# EAGLE board FrequencyCounter (EAGLE 7.2.0)
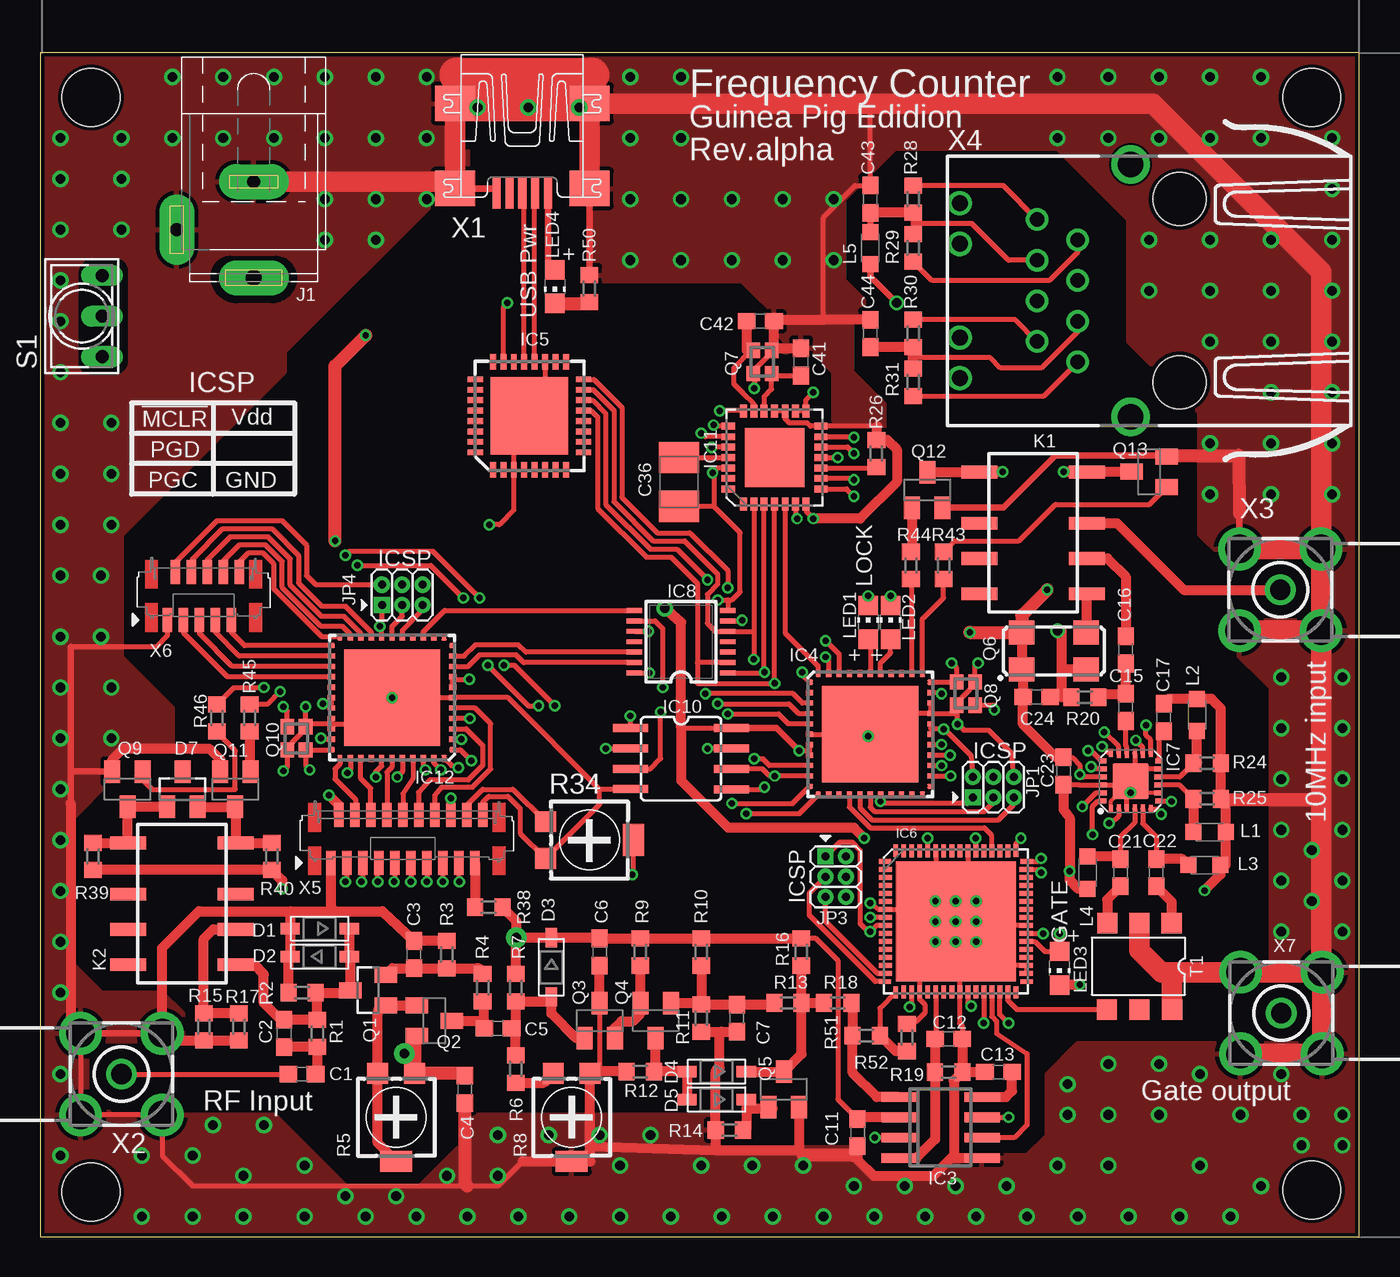
[diagram p2: board, top side]
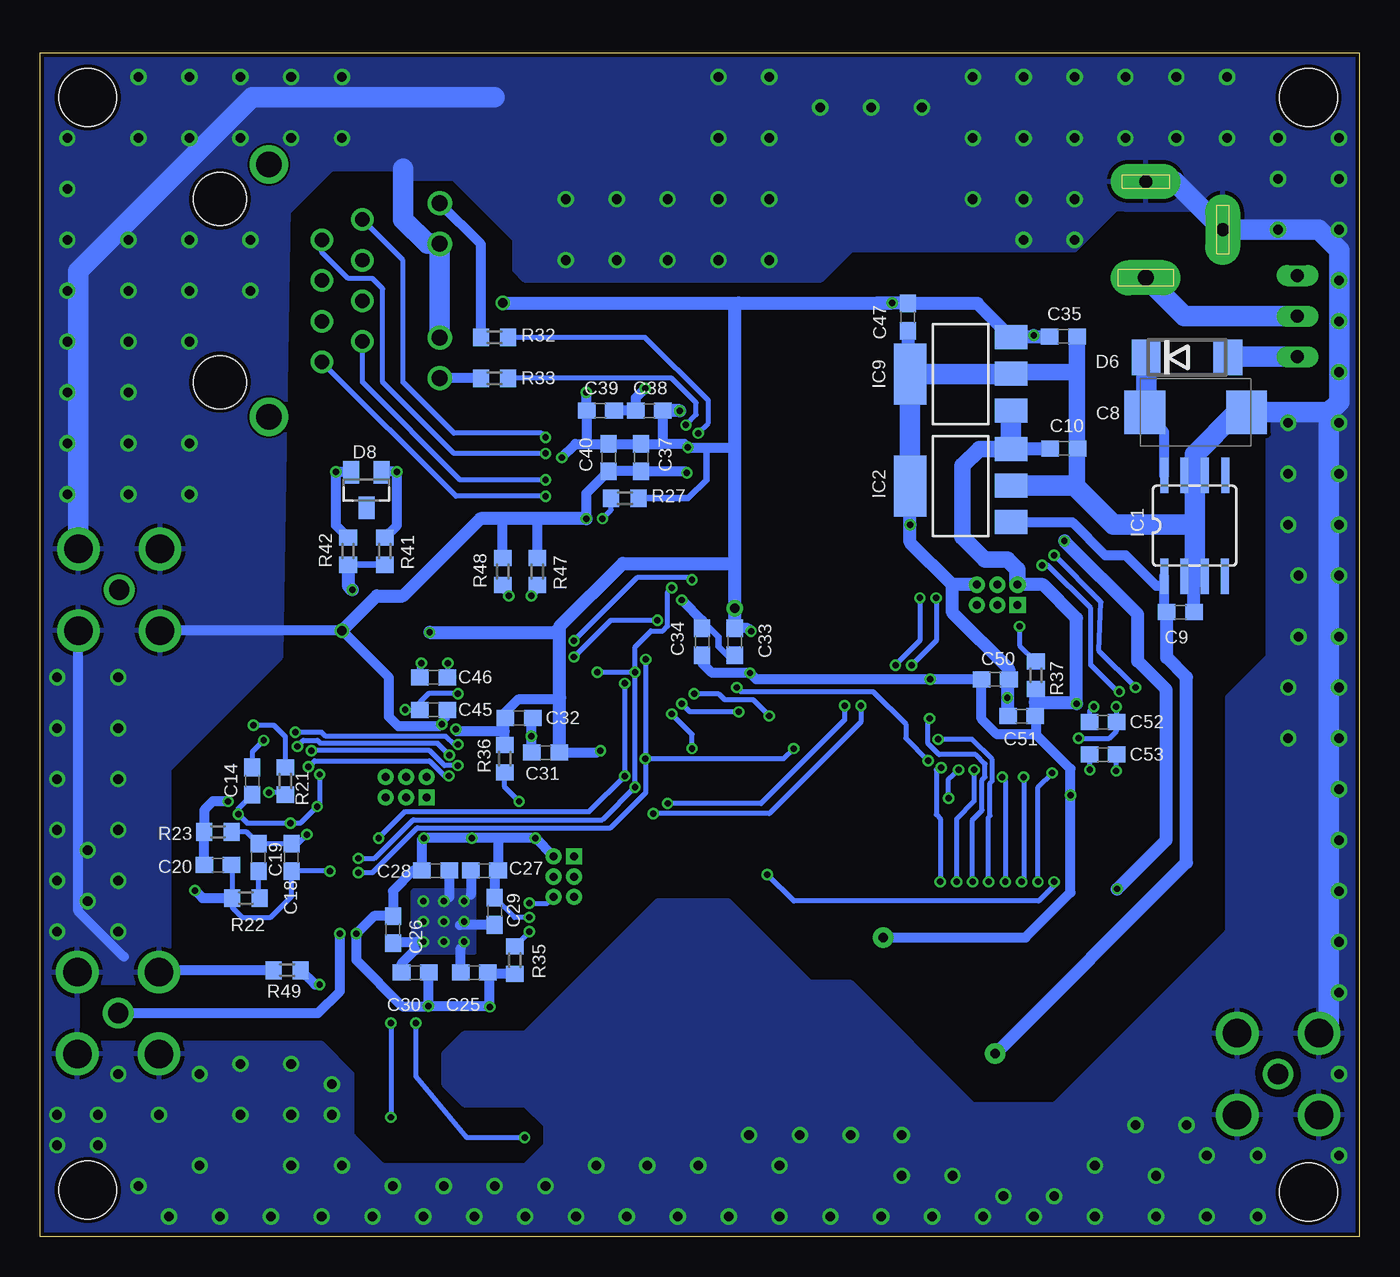
[diagram p3: board, bottom side, seen from below]

Size 82.35 x 73.9 mm. Coordinates in mm from the lower left corner, seen from the top.
Outline: 0,0 82.35,0 82.35,73.9 0,73.9 0,0
Copper layers (1*16): Top 0.035mm / dielectric 1.5mm / Bottom 0.035mm
Design rules "dirt_cheap_dirty_boards.v1 *": minimum track width 5mil, minimum drill 12mil, track to track 5mil, track to pad 5mil, pad to pad 5mil, via to via 5mil, smd to smd 0mil, copper to edge 10mil, drill to drill 10mil, minimum pad ring 10mil, minimum via ring 6mil, stop-mask expansion 2mil, vias tented up to drill 25mil, thermal gap 10mil
Holes 3.6 mm at 79.38,71.12 3.17,71.12 3.17,2.79 79.38,2.92

## Footprints (pad centres in the part's own frame; a part is rotated, then mirrored left to right if it is on the bottom)
C0603 = smd 1.1 x 1: 1 -0.85,0; 2 0.85,0
D/7343-31R = smd 2.55 x 2.7: + 3.175,0; - -3.175,0
B/3528-21R = smd 1.95 x 2.5: + 1.525,0; - -1.525,0
SOD-123 = smd 1.2 x 0.7: A 1.85,0; C -1.85,0
DO214AA = smd 1.8 x 2.2: A 2.55,0; C -2.55,0
SOT23 = smd 1 x 1.4: 1 -0.95,-1.1; 2 0.95,-1.1; 3 0,1.1
SOIC8 = smd 2.2 x 0.5: 1 -3.154,1.905; 2 -3.154,0.645; 3 -3.154,-0.625; 4 -3.154,-1.895; 5 3.154,-1.905; 6 3.154,-0.635; 7 3.154,0.635; 8 3.154,1.905
SOT223 = smd 1.499 x 2.007: 1 -2.261,-3.15; 2 0.025,-3.15; 3 2.311,-3.15 | smd 3.81 x 2.007: 4 0,3.15
SO08 = smd 0.6 x 2.2: 1 -1.905,-2.6; 2 -0.635,-2.6; 3 0.635,-2.6; 4 1.905,-2.6; 5 1.905,2.6; 6 0.635,2.6; 7 -0.635,2.6; 8 -1.905,2.6
QFN44ML8X8 = smd 0.45 x 0.33: 1 -3.788,3.25; 2 -3.788,2.6; 3 -3.788,1.95; 4 -3.788,1.3; 5 -3.788,0.65; 6 -3.788,0; 7 -3.788,-0.65; 8 -3.788,-1.3; 9 -3.788,-1.95; 10 -3.788,-2.6; 11 -3.788,-3.25; 23 3.788,-3.25; 24 3.788,-2.6; 25 3.788,-1.95; 26 3.788,-1.3; 27 3.788,-0.65; 28 3.788,0; 29 3.788,0.65; 30 3.788,1.3; 31 3.788,1.95; 32 3.788,2.6; 33 3.788,3.25 | smd 0.33 x 0.45: 12 -3.25,-3.788; 13 -2.6,-3.788; 14 -1.95,-3.788; 15 -1.3,-3.788; 16 -0.65,-3.788; 17 0,-3.788; 18 0.65,-3.788; 19 1.3,-3.788; 20 1.95,-3.788; 21 2.6,-3.788; 22 3.25,-3.788; 34 3.25,3.788; 35 2.6,3.788; 36 1.95,3.788; 37 1.3,3.788; 38 0.65,3.788; 39 0,3.788; 40 -0.65,3.788; 41 -1.3,3.788; 42 -1.95,3.788; 43 -2.6,3.788; 44 -3.25,3.788 | smd 6 x 6: EXP 0,0
TQFN32 = smd 0.965 x 0.366: 1 -3.378,2.275; 2 -3.378,1.625; 3 -3.378,0.975; 4 -3.378,0.325; 5 -3.378,-0.325; 6 -3.378,-0.975; 7 -3.378,-1.625; 8 -3.378,-2.275; 17 3.378,-2.275; 18 3.378,-1.625; 19 3.378,-0.975; 20 3.378,-0.325; 21 3.378,0.325; 22 3.378,0.975; 23 3.378,1.625; 24 3.378,2.275 | smd 0.366 x 0.965: 9 -2.275,-3.378; 10 -1.625,-3.378; 11 -0.975,-3.378; 12 -0.325,-3.378; 13 0.325,-3.378; 14 0.975,-3.378; 15 1.625,-3.378; 16 2.275,-3.378; 25 2.275,3.378; 26 1.625,3.378; 27 0.975,3.378; 28 0.325,3.378; 29 -0.325,3.378; 30 -0.975,3.378; 31 -1.625,3.378; 32 -2.275,3.378 | smd 4.851 x 4.851: EXP 0,0
QFN64_9X9MC = smd 0.762 x 0.305: 1 -4.42,3.75; 16 -4.42,-3.75; 33 4.42,-3.75; 48 4.42,3.75 | smd 0.813 x 0.305: 2 -4.394,3.25; 3 -4.394,2.75; 4 -4.394,2.25; 5 -4.394,1.75; 6 -4.394,1.25; 7 -4.394,0.75; 8 -4.394,0.25; 9 -4.394,-0.25; 10 -4.394,-0.75; 11 -4.394,-1.25; 12 -4.394,-1.75; 13 -4.394,-2.25; 14 -4.394,-2.75; 15 -4.394,-3.25; 34 4.394,-3.25; 35 4.394,-2.75; 36 4.394,-2.25; 37 4.394,-1.75; 38 4.394,-1.25; 39 4.394,-0.75; 40 4.394,-0.25; 41 4.394,0.25; 42 4.394,0.75; 43 4.394,1.25; 44 4.394,1.75; 45 4.394,2.25; 46 4.394,2.75; 47 4.394,3.25 | smd 0.305 x 0.762: 17 -3.75,-4.42; 32 3.75,-4.42; 49 3.75,4.42; 64 -3.75,4.42 | smd 0.305 x 0.813: 18 -3.25,-4.394; 19 -2.75,-4.394; 20 -2.25,-4.394; 21 -1.75,-4.394; 22 -1.25,-4.394; 23 -0.75,-4.394; 24 -0.25,-4.394; 25 0.25,-4.394; 26 0.75,-4.394; 27 1.25,-4.394; 28 1.75,-4.394; 29 2.25,-4.394; 30 2.75,-4.394; 31 3.25,-4.394; 50 3.25,4.394; 51 2.75,4.394; 52 2.25,4.394; 53 1.75,4.394; 54 1.25,4.394; 55 0.75,4.394; 56 0.25,4.394; 57 -0.25,4.394; 58 -0.75,4.394; 59 -1.25,4.394; 60 -1.75,4.394; 61 -2.25,4.394; 62 -2.75,4.394; 63 -3.25,4.394 | smd 7.493 x 7.493: 65 0,0
LFCSP24 = smd 0.5 x 0.3: 1 -1.75,1.25; 6 -1.75,-1.25; 13 1.75,-1.25; 18 1.75,1.25 | smd 0.55 x 0.3: 2 -1.725,0.75; 3 -1.725,0.25; 4 -1.725,-0.25; 5 -1.725,-0.75; 14 1.725,-0.75; 15 1.725,-0.25; 16 1.725,0.25; 17 1.725,0.75 | smd 0.3 x 0.5: 7 -1.25,-1.75; 12 1.25,-1.75; 19 1.25,1.75; 24 -1.25,1.75 | smd 0.3 x 0.55: 8 -0.75,-1.725; 9 -0.25,-1.725; 10 0.25,-1.725; 11 0.75,-1.725; 20 0.75,1.725; 21 0.25,1.725; 22 -0.25,1.725; 23 -0.75,1.725 | smd 2.25 x 2.25: EXP 0,0
TSSOP14 = smd 0.991 x 0.305: 1 -2.918,1.95; 2 -2.918,1.3; 3 -2.918,0.65; 4 -2.918,0; 5 -2.918,-0.65; 6 -2.918,-1.3; 7 -2.918,-1.95; 8 2.918,-1.95; 9 2.918,-1.3; 10 2.918,-0.65; 11 2.918,0; 12 2.918,0.65; 13 2.918,1.3; 14 2.918,1.95
QFN65P600X600X100-29N = smd 0.813 x 0.432: 1 -2.896,1.956; 2 -2.896,1.295; 3 -2.896,0.66; 4 -2.896,0; 5 -2.896,-0.66; 6 -2.896,-1.295; 7 -2.896,-1.956; 15 2.896,-1.956; 16 2.896,-1.295; 17 2.896,-0.66; 18 2.896,0; 19 2.896,0.66; 20 2.896,1.295; 21 2.896,1.956 | smd 0.432 x 0.813: 8 -1.956,-2.896; 9 -1.295,-2.896; 10 -0.66,-2.896; 11 0,-2.896; 12 0.66,-2.896; 13 1.295,-2.896; 14 1.956,-2.896; 22 1.956,2.896; 23 1.295,2.896; 24 0.66,2.896; 25 0,2.896; 26 -0.66,2.896; 27 -1.295,2.896; 28 -1.956,2.896 | smd 3.708 x 3.708: 29 0,0
SPC4077 = drill 0.8 pad 2.184 long: 1 -3,0; 2 0,-4.8 | drill 1 pad 2.184 long: 3 3,0
2X03_1.27 = drill 0.5 square: 1 -1.27,-0.635 | drill 0.5: 2 -1.27,0.635; 3 0,-0.635; 4 0,0.635; 5 1.27,-0.635; 6 1.27,0.635
FTR-B4S = smd 0.8 x 2.25: 1 -3.8,-3.345; 2 -0.6,-3.345; 3 1.6,-3.345; 4 3.8,-3.345; 5 3.8,3.345; 6 1.6,3.345; 7 -0.6,3.345; 8 -3.8,3.345
L2012C = smd 1 x 1: 1 -1,0; 2 1,0
CHIP-LED0805 = smd 1.2 x 1.2: A 0,-1.05; C 0,1.05
SOT23-BEC = smd 1 x 1.4: B -0.95,-1.1; C 0,1.1; E 0.95,-1.1
FOX924 = smd 1.6 x 1.5: 1 -1.885,-1.15; 2 2.139,-1.15; 3 2.139,1.15; 4 -1.885,1.15
FA-128 = smd 0.95 x 0.85: 1 -0.725,-0.575; 2 0.725,-0.575; 3 0.725,0.575; 4 -0.725,0.575
R0603 = smd 1 x 1.1: 1 -0.85,0; 2 0.85,0
RTRIM4G/J = smd 1.3 x 1.3: 1 -1.15,-2.75; 3 1.15,-2.75 | smd 2 x 1.3: 2 0,2.75
9450-1-NOHOLE = drill 0.813 long: 1 -2.54,-1.27; 2 0,-1.27; 3 2.54,-1.27
PULSE_CX20 = smd 1.27 x 1.27: P$1 -2.696,1.905; P$2 -2.696,-0.095; P$3 -2.696,-2.095; P$4 2.696,-2.127; P$5 2.696,-0.095; P$6 2.696,1.937
UX60A-MB-5ST = smd 2 x 0.5: 1 2.25,1.6; 2 2.25,0.8; 3 2.25,0; 4 2.25,-0.8; 5 2.25,-1.6 | smd 2.2 x 2.5: M1 -3.3,-4.2; M2 -3.3,4.2; M3 2,4.2; M4 2,-4.2
BU-SMA-H = drill 1.27: 1 0,0 | drill 1.778: 2 -2.55,2.55; 3 2.55,2.55; 4 2.55,-2.55; 5 -2.55,-2.55
J1 = drill 0.9 pad 1.3: 1 4.445,2.54; 2 3.175,0; 3 1.905,2.54; 4 0.635,0; 5 -0.635,2.54; 6 -1.905,0; 7 -3.175,2.54; 8 -4.445,0 | drill 1 pad 1.422: 9 5.465,7.37; 10 2.925,7.37; 11 -2.925,7.37; 12 -5.465,7.37 | drill 1.6 pad 2.184: M1 -7.875,-3.3; M2 7.875,-3.3 | hole 3.3: 5.715,-6.35; -5.715,-6.35
FH12-20S-0.5SV = smd 0.6 x 1.5: 1 -4.46,-1.5; 2 -3.96,1.5; 3 -3.46,-1.5; 4 -2.96,1.5; 5 -2.46,-1.5; 6 -1.96,1.5; 7 -1.46,-1.5; 8 -0.96,1.5; 9 -0.46,-1.5; 10 0.04,1.5; 11 0.54,-1.5; 12 1.04,1.5; 13 1.54,-1.5; 14 2.04,1.5; 15 2.54,-1.5; 16 3.04,1.5; 17 3.54,-1.5; 18 4.04,1.5; 19 4.54,-1.5; 20 5.04,1.5
FH12-10S-0.5SV = smd 0.6 x 1.5: 1 -2.21,-1.5; 2 -1.71,1.5; 3 -1.21,-1.5; 4 -0.71,1.5; 5 -0.21,-1.5; 6 0.29,1.5; 7 0.79,-1.5; 8 1.29,1.5; 9 1.79,-1.5; 10 2.29,1.5

## Placement (x,y rotation side)
C1  1.5uF  [C0603]  16.35,10.16 0 top
C2  47pF  [C0603]  15.24,12.7 90 top
C3  470pF  [C0603]  23.34,17.62 90 top
C4  0.1  [C0603]  26.51,9.21 270 top
C5  47nF  [C0603]  28.57,13.02 180 top
C6  0.1  [C0603]  34.92,17.78 270 top
C7  56pF  [C0603]  43.5,13.65 90 top
C8  100uF  [D/7343-31R]  10.22,51.47 180 bottom
C9  1uF  [C0603]  11.18,38.99 0 bottom
C10  1uF  [C0603]  18.45,49.21 0 bottom
C11  0.1  [C0603]  51.02,6.51 270 top
C12  8pF  [C0603]  56.71,12.35 0 top
C13  0.1  [C0603]  59.82,10.29 180 top
C14  10uF  [C0603]  69.1,28.45 270 bottom
C15  1nF  [C0603]  67.75,33.05 90 top
C16  1nF  [C0603]  67.75,36.64 90 top
C17  1nF  [C0603]  70.14,32.42 90 top
C18  47pF  [C0603]  66.64,23.69 90 bottom
C19  680pF  [C0603]  68.71,23.69 90 bottom
C20  22nF  [C0603]  71.25,23.21 180 bottom
C21  100pF  [C0603]  67.44,22.73 270 top
C22  100pF  [C0603]  69.66,22.73 90 top
C23  0.1  [C0603]  63.88,29.08 270 top
C24  0.1  [C0603]  62.2,33.69 0 top
C25  0.1  [C0603]  55.24,16.51 180 bottom
C26  0.1  [C0603]  60.33,19.18 270 bottom
C27  0.1  [C0603]  54.61,22.86 180 bottom
C28  0.1  [C0603]  57.66,22.86 0 bottom
C29  0.1  [C0603]  53.98,20.32 270 bottom
C30  0.1  [C0603]  58.93,16.51 180 bottom
C31  0.1  [C0603]  50.8,30.23 180 bottom
C32  0.1  [C0603]  52.45,32.38 0 bottom
C33  0.1  [C0603]  38.99,37.15 270 bottom
C34  0.1  [C0603]  41.02,37.15 90 bottom
C35  1uF  [C0603]  18.48,56.2 0 bottom
C36  10uF  [B/3528-21R]  39.88,47.12 90 top
C37  0.1  [C0603]  44.83,48.64 270 bottom
C38  0.1  [C0603]  44.32,51.56 180 bottom
C39  0.1  [C0603]  47.37,51.56 0 bottom
C40  0.1  [C0603]  46.86,48.64 270 bottom
C41  18pF  [C0603]  47.5,54.61 90 top
C42  18pF  [C0603]  44.96,57.15 0 top
C43  0.01uF  [C0603]  51.82,64.77 90 top
C44  0.01uF  [C0603]  51.82,56.39 90 top
C45  18pF  [C0603]  57.78,32.89 0 bottom
C46  18pF  [C0603]  57.78,34.92 180 bottom
C47  0.1  [C0603]  28.19,57.4 270 bottom
C50  0.1  [C0603]  22.73,34.8 0 bottom
C51  0.1  [C0603]  21.08,32.51 180 bottom
C52  18pF  [C0603]  16,32.13 180 bottom
C53  18pF  [C0603]  16,30.1 0 bottom
D1  1N4148  [SOD-123]  17.46,19.24 180 top
D2  1N4148  [SOD-123]  17.46,17.49 0 top
D3  1N4148  [SOD-123]  31.91,16.83 270 top
D4  1N4148  [SOD-123]  42.23,10.32 180 top
D5  1N4148  [SOD-123]  42.23,8.57 180 top
D6  SS24  [DO214AA]  10.76,54.9 0 bottom
D7  DZ23  [SOT23]  8.89,27.94 0 top
D8  DZ23  [SOT23]  61.98,46.61 180 bottom
IC1  UA7809  [SOIC8]  10.29,44.39 90 bottom
IC2  UA78M05  [SOT223]  24.89,46.86 90 bottom
IC3  MC12080D  [SO08]  56.2,6.83 270 top
IC4  PIC18F4550_QFN  [QFN44ML8X8]  51.82,31.37 0 top
IC5  MAX3421E  [TQFN32]  30.54,51.24 90 top
IC6  PIC32MZXXXXEC(G/H/M)064-I/MR  [QFN64_9X9MC]  57.15,19.68 0 top
IC7  ADF4360-8  [LFCSP24]  68.07,28.45 90 top
IC8  MAX33XXE  [TSSOP14]  40.01,37.15 180 top
IC9  UA78M33  [SOT223]  24.89,53.85 90 bottom
IC10  SST25  [SOIC8]  40.01,29.84 0 top
IC11  ENC28J60-I/ML  [QFN65P600X600X100-29N]  45.85,48.64 90 top
IC12  PIC18F4550_QFN  [QFN44ML8X8]  21.97,33.66 180 top
J1  JACK  [SPC4077]  13.34,62.87 270 top
JP1  PINHEAD  [2X03_1.27]  59.5,28.07 0 top
JP3  PINHEAD  [2X03_1.27]  49.66,22.48 270 top
JP4  PINHEAD  [2X03_1.27]  22.61,40.07 0 top
K1  FTR-B4S  [FTR-B4S]  61.98,43.94 270 top
K2  FTR-B4S  [FTR-B4S]  8.86,20.8 270 top
L1  68nH  [L2012C]  72.99,25.27 0 top
L2  68nH  [L2012C]  72.2,32.58 90 top
L3  56nH  [L2012C]  72.68,23.21 0 top
L4  56nH  [L2012C]  65.37,22.73 270 top
L5  15uH  [L2012C]  51.82,61.72 90 top
LED1  [CHIP-LED0805]  51.69,38.35 0 top
LED2  [CHIP-LED0805]  53.09,38.35 0 top
LED3  [CHIP-LED0805]  63.63,16.76 180 top
LED4  [CHIP-LED0805]  32.13,59.31 180 top
Q1  SST5484  [SOT23]  20.48,15.4 90 top
Q2  BFT92  [SOT23-BEC]  24.61,13.49 270 top
Q3  BFT92  [SOT23-BEC]  34.92,13.49 0 top
Q4  BFT92  [SOT23-BEC]  38.42,13.49 180 top
Q5  BFT93  [SOT23-BEC]  46.42,9.21 0 top
Q6  FOX924  [FOX924]  63.15,36.58 0 top
Q7  FA-128  [FA-128]  45.09,54.61 90 top
Q8  FA-128  [FA-128]  57.78,33.91 90 top
Q9  BC817  [SOT23-BEC]  5.46,27.94 180 top
Q10  FA-128  [FA-128]  16,31.11 270 top
Q11  BC817  [SOT23-BEC]  12.19,27.94 180 top
Q12  BC817  [SOT23-BEC]  55.37,46.61 0 top
Q13  BC817  [SOT23-BEC]  69.22,47.75 90 top
R1  100K  [R0603]  17.3,12.7 270 top
R2  1M  [R0603]  16.35,15.24 180 top
R3  100  [R0603]  25.4,17.62 90 top
R4  300  [R0603]  27.62,15.56 90 top
R5  500  [RTRIM4G/J]  22.23,7.46 180 top
R6  15K  [R0603]  29.69,10.48 270 top
R7  15K  [R0603]  29.69,15.56 270 top
R8  6.8K  [RTRIM4G/J]  33.18,7.46 180 top
R9  100  [R0603]  37.47,17.78 270 top
R10  470  [R0603]  41.27,17.78 270 top
R11  1K  [R0603]  41.27,13.65 270 top
R12  300  [R0603]  37.47,10.32 180 top
R13  8.2k  [R0603]  46.67,14.61 180 top
R14  1K  [R0603]  43.02,6.67 180 top
R15  100  [R0603]  10.22,13.11 270 top
R16  1K  [R0603]  47.5,17.78 270 top
R17  100  [R0603]  12.41,13.11 270 top
R18  1K  [R0603]  49.78,14.61 180 top
R19  820  [R0603]  56.71,10.29 0 top
R20  51  [R0603]  65.21,33.69 180 top
R21  4.7k  [R0603]  67.04,28.45 270 bottom
R22  6.8k  [R0603]  69.5,21.15 180 bottom
R23  15k  [R0603]  71.25,25.27 0 bottom
R24  470  [R0603]  72.83,29.56 0 top
R25  470  [R0603]  72.83,27.34 0 top
R26  2k 1%  [R0603]  52.2,48.9 90 top
R27  10k  [R0603]  45.85,46.1 0 bottom
R28  50 1%  [R0603]  54.48,64.77 90 top
R29  50 1%  [R0603]  54.48,61.72 90 top
R30  50 1%  [R0603]  54.48,56.39 90 top
R31  50 1%  [R0603]  54.48,53.34 90 top
R32  180  [R0603]  53.98,56.13 0 bottom
R33  180  [R0603]  53.98,53.59 0 bottom
R34  10K  [RTRIM4G/J]  34.29,24.77 270 top
R35  4.7k  [R0603]  52.7,17.27 90 bottom
R36  4.7k  [R0603]  53.34,29.84 270 bottom
R37  4.7k  [R0603]  20.19,35.05 90 bottom
R38  4.7k  [R0603]  28,20.57 0 top
R39  47  [R0603]  3.3,23.75 90 top
R40  47  [R0603]  14.48,23.75 90 top
R41  47  [R0603]  60.83,42.8 90 bottom
R42  47  [R0603]  63.12,42.8 90 bottom
R43  4.7k  [R0603]  56.39,41.91 90 top
R44  4.7k  [R0603]  54.36,41.91 90 top
R45  4.7k  [R0603]  13.08,32.38 270 top
R46  4.7k  [R0603]  11.05,32.38 90 top
R47  180  [R0603]  51.31,41.53 90 bottom
R48  180  [R0603]  53.47,41.53 90 bottom
R49  180  [R0603]  66.93,16.64 180 bottom
R50  180  [R0603]  34.29,59.18 90 top
R51  [R0603]  51.56,12.57 0 top
R52  [R0603]  54.1,12.45 90 top
S1  9450-1NOHOLE  [9450-1-NOHOLE]  2.6,57.47 90 top
T1  CX20XX  [PULSE_CX20]  68.71,16.89 270 top
X1  MINI-USB-SHIELD  [UX60A-MB-5ST]  30.1,67.44 270 top
X2  BU-SMA-H  [BU-SMA-H]  5.08,10.16 180 top
X3  BU-SMA-H  [BU-SMA-H]  77.41,40.39 0 top
X4  J1006F01P  [J1]  64.77,59.05 90 top
X5  FH12-20S-0.5SV  [FH12-20S-0.5SV]  22.61,24.83 0 top
X6  FH12-10S-0.5SV  [FH12-10S-0.5SV]  10.16,40.01 0 top
X7  BU-SMA-H  [BU-SMA-H]  77.47,13.97 0 top

## Tracks (layer width: path | path; a pad name or v marks a point on that pad's centre or on a via)
50TERM_RESET  (via drill 0.4 pad 0.61)
  Top 0.305: R46.2 12.1,34.29 v13.97,34.29 | v19.05,42.55 19.3,42.8 24.51,42.8 v27.43,39.88 | v43.18,27.05 46.96,27.05 IC4.11 | v28.96,35.69 29.59,35.69 v32.13,33.15
  Bottom 0.305: v13.97,34.29 16.26,36.58 16.13,39.62 v19.05,42.55 | v43.18,27.05 37.34,27.05 32.13,32.26 v32.13,33.15 | v27.43,39.88 27.43,37.21 v28.96,35.69
50TERM_SET  (via drill 0.4 pad 0.61)
  Top 0.305: v19.81,41.91 24.38,41.91 v26.42,39.88 | R45.1 13.12,33.27 14.22,33.27 v14.99,34.04 | v44.07,26.42 47.4,26.42 IC4.12 | v27.94,35.69 30.48,33.15 v31.11,33.15
  Bottom 0.305: v19.81,41.91 19.43,41.91 16.76,39.24 16.76,35.69 15.11,34.04 v14.99,34.04 | v44.07,26.42 36.83,26.42 31.11,32.13 v31.11,33.15 | v26.42,39.88 26.42,37.21 v27.94,35.69
+3V3  (via drill 0.4 pad 0.41, 0.4 pad 0.61, 0.6 pad 0.81, 0.6 pad 1.02)
  Top 0.305: IC7.6 69.66,26.7 v69.98,26.38 | IC7.23 65.89,27.7 v65.06,26.86 | IC7.2 67.32,26.24 66.91,25.83 v66.72,25.83 | C23.1 64.32,29.88 64.48,29.88 64.9,29.46 v64.9,28.86 65.06,28.7 IC7.21 | IC6.39 62.23,18.93 v62.61,18.92 | IC6.54 v58.4,24.89 | IC6.19 54.4,14.59 v54.28,14.35 | IC6.26 57.9,14.62 v58.12,14.4 | IC6.60 v55.4,24.89 | IC4.28 IC4.29 55.6,31.69 v56.39,31.69 56.52,31.62 58.1,30.04 JP1.2 | IC4.7 IC4.8 48.03,30.35 v47.37,30.35 | IC11.16 IC11.15 47.8,52.25 v48.26,52.7 | IC11.24 42.14,49.3 v41.91,49.28 | IC11.11 v49.78,48.64 | IC11.21 43.87,51.56 v42.42,51.56 | Q6.1 61.35,35.6 | IC6.8 52.45,19.94 v51.82,19.94 | IC8.10 v37.97,37.8 | 40.01,31.75 42.55,31.75 | IC5.23 28.92,58.04 v29.17,58.29
  Top 0.406: v47.37,30.35 45.97,31.75 IC10.8 | L5.1 51.82,59.94 v53.47,58.29
  Top 0.61: C23.1 63.41,29.93 61.35,32 C24.1 61.35,35.6 | v38.99,39.24 40.01,38.35 40.01,31.75 40.01,28.48 42.96,25.53 50.8,25.53 v51.44,24.89 | Q6.4 Q6.1 | R39.1 R40.1 15.11,22.26 v15.11,21.72
  Top 0.813: v58.03,37.73 Q6.4 61.27,38.79 v62.87,40.39 | v18.41,43.43 18.41,54.36 v20.32,56.26
  Bottom 0.305: v69.98,26.38 69.98,26.73 C14.2 | 69.82,26.23 v69.98,26.38 | v69.98,26.38 69.42,25.83 v66.72,25.83 66.09,25.83 v65.06,26.86 64.9,27.02 v64.9,28.86 | v54.28,14.35 54.41,14.49 54.49,14.4 | C30.1 58.12,16.47 | 58.51,24.78 v58.4,24.89 | 53.98,22.64 C27.1 53.72,22.9 | 54.41,16.5 C25.1 54.4,16.42 | 48.26,51.6 C39.1 | 44.79,49.53 C37.1 | C40.1 48.22,49.49 | 53.34,32.35 C32.1 | v51.82,19.94 52.74,19.94 C29.1 | 50.04,33.53 49.91,33.66 | 56.33,31.56 56.33,31.62 | 50.28,37.73 arc-90 49.91,38.1
  Bottom 0.406: 45.09,46.1 41.91,46.1 40.77,47.24 40.77,49.28 v41.91,49.28 | R42.1 R41.1 | 38.99,58.04 38.73,58.29
  Bottom 0.61: 58.12,16.47 v58.12,14.4 | 58.51,24.78 C28.1 59.05,22.86 60.33,21.59 C26.1 61.51,20.03 v62.61,18.92 62.61,17.27 59.74,14.4 v58.12,14.4 | 53.98,22.64 C29.1 | 54.49,14.4 v58.12,14.4 | v58.4,24.89 v55.4,24.89 53.72,24.89 | C31.1 47.62,30.23 v47.37,30.35 | 50.04,33.53 52.53,33.53 53.3,32.75 C32.1 | v48.26,52.7 48.26,51.6 | v49.78,48.64 48.93,49.49 C40.1 C37.1 43.47,49.49 | 43.47,49.49 C38.1 | 43.47,49.49 42.12,49.49 v41.91,49.28 38.99,49.28 38.99,49.4 | 48.22,49.49 C39.1 | R35.1 54.4,16.42 | 53.72,24.89 v51.44,24.89 JP3.2 | 53.72,22.9 53.72,24.89 | v37.97,37.8 38.17,38 C33.1 | R27.2 45.09,46.1 | R36.1 53.34,31.56 | 53.34,31.56 53.34,32.35 | 53.34,31.56 56.33,31.56 | 56.33,31.62 v56.39,31.69 | v54.28,14.35 54.28,16.39 C25.1
  Bottom 0.813: v42.42,51.56 C38.1 | 20.32,56.2 21.74,56.2 IC9.3 23.84,58.25 C47.1 28.23,58.29 v29.17,58.29 | 20.32,56.2 C35.1 | C31.1 49.91,30.23 49.91,33.66 49.91,38.1 45.97,42.04 38.99,42.04 | C33.1 v38.99,39.24 38.99,42.04 | 38.99,42.04 38.99,49.4 38.99,58.04 | v58.03,37.73 50.28,37.73 | R42.1 63.12,40.64 v62.87,40.39 | v15.11,21.72 12.06,24.77 12.06,34.16 13.84,35.94 13.84,38.86 v18.41,43.43 | v20.32,56.26 20.32,56.2 | v29.17,58.29 30.1,58.29 | v53.47,58.29 38.73,58.29 v29.17,58.29
+5V  (via drill 0.4 pad 0.61, 0.6 pad 1.27)
  Top 0.305: R16.1 48.43,18.63 49.78,17.27 49.78,8.6 C11.1 | IC12.29 IC12.28 18.18,33.27 v17.65,33.27 | IC8.14 v38.04,35.2 | v26.8,34.8 25.76,34.8 IC12.8 IC12.7 | X6.2 8.45,42.1 11.05,44.7 15.11,44.7 16.64,43.18 16.64,41.27 17.21,40.7 JP4.2
  Top 0.61: R7.1 29.72,16.44 v29.72,18.68 | R16.1 R10.1 R9.1 C6.1 34.88,18.68 D3.C v29.72,18.68 | IC3.2 51.28,7.46 C11.1 | X5.2 18.65,26.95 v18.03,27.56 | R38.2 29.72,19.71 v29.72,18.68
  Bottom 0.305: R37.1 20.23,34.16
  Bottom 0.61: 17.72,33.37 arc90 v17.65,33.27 | C51.1 20.19,32.51 20.19,31.37 | 20.19,31.37 22.62,31.37 23.58,32.34 C50.1 v26.8,34.8 37.64,34.8 v38.04,35.2 40.4,35.2 41.02,35.82 C34.1 | 20.19,31.37 18.03,29.21 v18.03,27.56 18.03,21.49 20.85,18.68 v29.72,18.68
  Bottom 0.813: IC2.3 21.74,49.21 C10.1 | 20.23,34.16 20.23,33.37 | 20.23,33.37 C51.1 | 20.23,33.37 17.72,33.37 | v17.65,33.27 17.65,38.61 19.75,40.7 JP4.2
  Bottom 1.016: JP4.2 21.34,41.66 21.97,42.29 23.37,42.29 24.77,43.69 24.77,48.13 23.72,49.17 IC2.3
  Bottom 1.27: IC2.3 IC9.1
+9V  (via drill 0.6 pad 1.27)
  Top 0.305: Q2.E 23.38,12.41
  Top 0.61: C4.1 26.51,10.21
  Top 0.813: 26.51,10.21 R5.1 23.38,11.43 | 23.38,12.41 23.38,11.43 | 23.38,11.43 v22.73,11.43
  Bottom 0.61: C9.1 12.19,39.16 12.19,40.64 | 12.19,40.64 IC1.1 | IC2.1 17.93,44.6 15.88,42.55 14.61,42.55 12.7,40.64 12.19,40.64
  Bottom 0.813: v22.73,11.43 10.79,23.37 10.79,34.92 12.03,36.16 C9.1
+12V
  Bottom 1.27: S1.2 10.94,57.47 J1.3
ATT_FREQ
  Top 0.305: IC6.17 52.41,14.28 R51.2
  Top 0.61: R51.2 53.39,11.6 R52.1
BUT1
  Top 0.305: IC12.26 11.7,34.95 8.95,37.7 X6.3
BUT2
  Top 0.305: X6.4 9.53,41.51 9.53,42.31 11.41,44.2 14.47,44.2 16.13,42.54 16.13,40.82 17.58,39.37 19.05,39.37 20.67,37.75 IC12.19
BUT3
  Top 0.305: IC12.25 11.99,35.6 9.95,37.65 X6.5
BUT4
  Top 0.305: IC12.20 20.02,37.69 18.98,38.73 17.56,38.73 15.62,40.68 15.62,42.31 14.25,43.69 11.86,43.69 10.45,42.28 X6.6
BUT5
  Top 0.305: IC12.24 12.44,36.26 10.95,37.74 X6.7
BUT6
  Top 0.305: IC12.21 19.37,37.6 18.87,38.1 17.56,38.1 15.11,40.54 15.11,42.16 14.09,43.18 12.42,43.18 11.43,42.19 11.43,41.51 X6.8
BUT7
  Top 0.305: IC12.23 12.76,36.91 11.95,37.72 X6.9
BUT8
  Top 0.305: IC12.22 17.59,37.44 14.61,40.43 14.61,41.99 13.92,42.67 12.99,42.67 12.45,42.14 X6.10
COUNTER_CLOCK
  Top 0.305: IC6.31 60.4,14.78 60.98,14.2 T1.P$4
COUNTER_MCLR  (via drill 0.4 pad 0.61)
  Top 0.305: JP3.1 49.91,24.64 50.67,24.64 51.18,24.13 51.18,19.56 51.69,19.05 v51.82,19.05 52.2,19.43 IC6.9
  Bottom 0.305: v51.82,19.05 51.82,19.01 R35.2
COUNTER_PGC
  Top 0.305: IC6.15 52.27,16.43 49.02,19.68 JP3.5
COUNTER_PGD
  Top 0.305: IC6.16 52.14,15.94 48.01,20.07 48.01,21.46 JP3.3
CPU_MCLR  (via drill 0.4 pad 0.61)
  Top 0.305: IC4.18 52.47,27.19 v52.45,27.18 52.58,27.05 57.85,27.05 JP1.1
  Bottom 0.305: v52.45,27.18 53.34,28.07 R36.2
CPU_PGC
  Top 0.305: IC4.16 51.18,26.77 51.92,26.04 59.82,26.04 60.77,26.99 JP1.5
CPU_PGD
  Top 0.305: IC4.17 51.82,26.82 52.09,26.54 58.93,26.54 59.5,27.11 JP1.3
ETH_LEDA  (via drill 0.4 pad 0.61)
  Top 0.305: IC11.23 41.5,49.94 v41.27,50.16
  Bottom 0.305: v41.27,50.16 40.64,50.8 40.64,52.2 44.58,56.13 R32.2
ETH_LEDB  (via drill 0.4 pad 0.61)
  Top 0.305: IC11.22 42.11,50.6 v42.04,50.67
  Bottom 0.305: v42.04,50.67 41.4,51.31 41.4,52.07 42.93,53.59 R33.2
ETH_OSC1
  Top 0.305: IC11.19 45.21,51.56 45.21,52.45 45.66,52.9 Q7.1 45.78,53.76 C41.1
ETH_OSC2
  Top 0.305: IC11.20 44.55,52 43.85,52.7 43.83,52.7 43.31,53.23 43.31,54.23 44.41,55.34 Q7.3
  Top 0.61: Q7.3 44.11,55.34 C42.1
FLASH_RST  (via drill 0.4 pad 0.61)
  Top 0.305: IC4.5 46.72,32.02 46.1,32.64 v42.93,32.64 | IC10.7 v41.66,30.48
  Bottom 0.305: v41.66,30.48 41.66,31.37 v42.93,32.64
FLASH_WP  (via drill 0.4 pad 0.61)
  Top 0.305: IC10.3 38.11,29.22 38.73,29.84 v38.73,32.77 | v42.29,33.27 46.74,33.27 47.34,32.67 IC4.4
  Bottom 0.305: v38.73,32.77 41.78,32.77 v42.29,33.27
GATE  (via drill 0.4 pad 0.61)
  Top 0.305: IC6.38 62.08,18.43 62.7,17.81 LED3.A
  Top 0.61: v63.63,18.92 LED3.A
  Bottom 0.61: X7.1 65,13.97 63.63,15.34 v63.63,18.92
GND  (via drill 0.4, 0.4 pad 0.61, 0.6, 0.6 pad 1.02)
  Top 0.254: IC7.1 66.85,26.72 66.85,27.22 IC7.EXP 68.07,27.7 IC7.8
  Top 0.305: IC7.11 68.07,29.2 IC7.EXP | IC7.EXP 68.07,28.2 IC7.22 64.9,28.2 | IC7.3 67.82,27.73 v68.06,27.73 | v68.06,27.73 IC7.EXP | IC7.15 68.32,28.45 IC7.EXP | 64.9,28.2 C23.2 64.1,28.07 | v68.06,27.73 68.07,27.73 IC7.EXP | 64.9,28.2 63.88,28.2 | v58.42,18.41 59.9,16.93 IC6.35 IC6.34 | IC6.40 58.67,19.43 v58.42,19.68 | v55.88,19.68 55.13,20.43 IC6.7 52.34,20.43 v51.82,20.83 | v55.88,18.41 54.9,17.43 IC6.20 54.9,14.82 55.24,14.48 55.24,14 54.71,13.46 54.14,13.46 arc90 R52.2 | v57.15,18.41 57.4,18.16 IC6.25 57.4,13.32 57.56,13.17 C12.2 | IC6.59 55.9,20.98 v55.88,20.95 | IC6.55 57.9,21.7 v57.15,20.95 | IC4.30 IC4.31 | IC4.30 53.12,32.67 IC4.EXP | IC4.6 IC4.EXP | v51.69,31.24 51.82,31.24 IC4.EXP | X2.4 X2.3 X2.2 7.63,5.07 9.53,3.17 26.67,3.17 28.57,3.17 30.13,4.73 | Q3.C 34.92,10.32 | 52.23,50.6 IC11.14 48.08,50.6 47.88,50.8 46.77,50.8 46.51,51.06 IC11.17 IC11.18 | IC11.26 42.27,47.98 v41.97,47.69 | v41.97,47.69 41.91,47.62 | 42.06,45.59 C36.- | 45.78,55.31 44.38,53.91 Q7.4 44.58,53.82 v44.58,52.96 | 45.78,55.31 Q7.2 | IC11.7 47.8,45.29 v48.26,44.83 | 45.81,57.24 C42.2 | 45.94,55.46 45.81,55.33 45.78,55.31 | Q8.4 57.53,33.66 57.91,34.04 arc16 Q8.2 58.36,35.63 v58.55,35.81 | Q8.4 57.21,32.07 arc90 v57.28,32 57.66,31.62 59.18,31.62 60.64,30.16 JP1.6 | IC4.30 57.21,32.67 Q8.4 | 18.18,32 20.19,32 20.19,33.66 IC12.EXP IC12.6 29.21,33.66 34.92,27.94 | IC12.31 18.18,32 | 18.18,32 IC12.30 | Q10.4 16.51,31.63 15.75,30.86 Q10.2 15.43,29.33 v15.18,29.08 | Q10.4 16.58,32.95 v16.57,33.08 | 18.18,32 16.58,32 Q10.4 | v28.04,44.45 28.66,44.45 29.57,45.35 IC5.3 29.57,51.24 IC5.EXP 31.52,51.24 IC5.19 | 53.51,47.16 53.47,47.12
  Top 0.305: 42.06,45.59 42.06,47.69 v41.97,47.69 | IC8.7 42.92,39.75 | 42.06,45.59 43.69,43.96 43.69,40.26 43.18,39.75 42.92,39.75 | 74.03,27.3 arc-90 73.99,27.34 R25.2 | IC10.4 34.92,27.94 | 51.82,70.74 C43.2 50.87,65.62 48.9,63.64 48.9,57.24 | v42.29,39.75 42.92,39.75 | X5.20 27.65,27.14 28,27.5 29.21,27.5 29.97,26.73 29.97,25.18 R34.3 34.92,27 34.92,27.94 | X6.1 7.95,37.55 7.23,36.83 1.91,36.83
  Top 0.406: X1.5 28.5,65.44 X1.M4 | X2.5 X2.4 | Q12.E 60.11,45.51 63.37,48.77 70.61,48.77 70.48,48.87 Q13.E | 74.86,45.16 X3.2 | 1.91,27.07 1.91,29.04 | 1.91,29.04 1.91,36.83 | Q9.E 1.91,29.04 | R50.2 34.3,62.57 X1.M3
  Top 0.61: R25.2 R24.2 73.68,32.99 73.11,33.58 L2.2 70.44,33.58 C17.2 | 73.99,27.34 L1.2 73.99,23.21 L3.2 73.68,22.62 v72.68,21.62 | L4.2 64.79,21.73 64.26,22.26 v64.26,22.84 64.26,26.16 63.88,26.67 63.88,28.2 | R2.2 15.5,17.51 D2.C D1.A 15.61,20.32 | R3.2 C3.2 21.4,20.28 21.36,20.32 18.41,20.32 | 30.13,4.73 30.16,4.71 R8.2 34.33,4.71 34.33,5.66 | Q3.C C6.2 | R12.2 34.92,10.32 34.33,10.32 R8.1 34.33,5.66 | Q5.E 47.37,5.41 42.17,5.41 | 51.05,5.46 51.05,5.66 C11.2 51.02,4.82 52.03,3.81 55.75,3.81 57.02,5.08 | 42.17,5.41 R14.2 42.17,10.29 arc-90 42.42,10.54 42.42,12.68 arc-90 42.55,12.8 | R11.2 42.55,12.8 | 42.55,12.8 C7.1 | 57.02,5.08 arc90 57.18,4.92 IC3.5 | 34.33,5.66 42.17,5.41 | v48.26,44.83 51.18,44.83 53.47,47.12 53.47,49.15 52.87,49.74 R26.2 52.23,50.6 | 45.94,55.46 C41.2 | 45.81,55.33 C42.2 | 45.81,57.24 48.9,57.24 C44.2 | R17.2 R15.2 8.08,12.26 X2.5 | X2.5 7.62,18.03 9.91,20.32 15.61,20.32 | 15.61,20.32 18.41,20.32 | X5.1 18.15,20.59 18.41,20.32 | Q9.E 4.51,29.8 5.2,30.48 10.55,30.48 11.24,29.79 Q11.E | 1.91,27.07 1.91,13.34 arc90 X2.4 | R20.2 63.75,33.69 | 63.75,33.69 C24.2 | v63.5,37.84 63.75,37.84 63.75,35.43 | 63.75,35.43 63.75,33.69 | Q6.2 63.75,35.43 | C12.2 R19.2 | R19.2 57.02,9.76 57.02,5.08 | R19.2 C13.2
  Top 0.813: 74.03,27.3 79.96,27.3 | 70.61,48.77 74.8,48.77 74.86,45.16 | C4.2 26.51,3.33 26.67,3.17 | 51.05,5.46 50.67,5.08 47.62,5.08
  Top 1.27: T1.P$2 68.61,17.88 69.97,16.52 70.48,16.52 | X3.3 X3.2 | X1.M1 X1.M4 25.47,65.86 J1.1 | X3.3 79.96,60.25 69.47,70.74 51.82,70.74 X1.M2 X1.M3 | X3.4 79.96,27.3 79.96,16.58 X7.3 | X3.4 X3.3 | X3.5 X3.4 | X7.3 X7.2 70.48,16.52 | X7.5 X7.4 X7.3 | T1.P$6 70.64,16.36 70.48,16.52
  Top 2.184: X1.M1 X1.M2 | 26.03,72.52 34.43,72.52
  Bottom 0.305: R21.2 67.04,27.73 v68.06,27.73 | C20.1 70.35,23.21 R22.2 70.35,20.56 69.75,19.95 67.94,19.95 66.64,21.26 C18.1 | v64.26,22.84 C18.1 | C18.1 | 56.13,19.47 56.13,19.43 | 56.81,21.21 56.77,21.21 | C26.2 60.33,18.41 | 56.09,18.03 56.13,18.03 | 55.46,21.38 v55.88,20.95 | 51.69,30.35 C31.2 | C32.2 51.69,32.38 | 58.55,35.01 C46.2 | v57.28,32 56.94,32.35 C45.2 | v51.82,20.83 50.67,20.83 JP3.6 | C50.2 21.97,34.8 | v15.18,29.08 15.18,30.07 C53.2 | v16.57,33.08 16.85,32.8 C52.2 | 41.02,38.06 C34.2 | 28.19,54 IC9.4
  Bottom 0.406: IC1.7 10.29,47.54 | 10.29,47.54 10.29,47.56 | IC1.6 10.29,47.54 | IC1.3 9.66,41.21 10.16,41.21 | 10.16,41.21 10.93,41.21 IC1.2 arc90 10.33,40.63 | 10.29,41.27 10.16,41.27 10.16,41.21 | C33.2 39.45,36.3 40.01,36.85 40.01,37.44 40.56,38 C34.2 | C46.2 58.63,35.81 v58.55,35.81
  Bottom 0.61: v72.68,21.62 72.2,21.14 R22.2 | C29.2 56.13,19.47 | C28.2 56.81,21.21 | 60.33,18.41 58.8,18.41 | C25.2 56.09,18.03 | C30.2 59.78,17.06 58.93,17.91 | C27.2 55.46,21.38 | 51.69,30.35 v51.69,31.24 51.69,32.38 | C39.2 C38.2 45.17,52.36 v44.58,52.96 | v41.97,47.69 42.08,47.79 C37.2 C40.2 48.26,46.39 v48.26,44.83 | 21.97,32.51 C51.2 | 41.02,38.06 41.02,38.48 v42.3,39.75 v42.29,39.75 | v57.28,32 57.47,31.88 59.98,31.88 60.57,32.46 60.57,34.91 v63.5,37.84 X3.5 | R47.2 51.31,44.83 | R48.2 53.47,44.7 53.34,44.83 | 77.12,17.49 79.96,20.32 X3.4 | R49.2 74.92,16.64 X7.2
  Bottom 0.813: C9.2 10.33,40.63 | 17.6,46.89 17.78,46.89 | 21.97,34.8 IC12.EXP 21.97,32.51 | C50.2 21.88,35.43 25.4,38.95 25.4,40.7 | IC2.4 v28.04,44.45 28.04,43.34 25.4,40.7 | JP4.6 25.4,40.7 | C47.2 28.19,54 | v48.26,44.83 51.31,44.83 53.34,44.83 54.86,44.83 59.69,40.01 61.33,40.01 v63.5,37.84
  Bottom 1.016: C35.2 17.63,53.98 | 17.63,53.98 17.63,49.21 | 17.63,49.21 C10.2 | 17.63,49.21 17.63,46.89 17.78,46.89 | IC9.2 21.74,53.98 17.63,53.98
  Bottom 1.27: 10.29,47.56 10.29,48.84 7.66,51.47 C8.- 1.91,51.47 | 10.29,47.54 10.29,44.45 | 10.29,44.45 10.29,41.27 | 10.29,44.45 15.37,44.45 17.8,46.89 | IC9.2 21.77,53.85 IC9.4 IC2.4 | 21.77,46.86 IC2.2 17.8,46.89 | 17.78,46.89 17.8,46.89 | 1.91,51.47 1.91,12.71 X2.4 | 53.98,71.12 69.11,71.12 79.96,60.27 X3.3 | X4.11 X4.10 58.17,61.98 59.69,63.5 59.69,66.67 | 1.91,51.47 1.27,52.1 1.27,61.59 2.54,62.87 J1.2 11.54,65.86 J1.1
  other vias: 57.15,19.68 58.42,20.95 21.97,33.66 6.35,1.27 9.53,1.27 12.7,1.27 16.51,1.27 20.32,1.27 23.5,1.27 26.67,1.27 29.84,1.27 33.02,1.27 36.2,1.27 39.37,1.27 42.55,1.27 45.72,1.27 48.9,1.27 52.07,1.27 55.24,1.27 58.42,1.27 61.59,1.27 64.77,1.27 67.94,1.27 71.12,1.27 74.3,1.27 76.2,3.17 78.74,5.71 81.28,5.71 81.28,7.62 78.74,7.62 77.47,10.16 74.93,7.62 72.39,10.16 69.85,7.62 66.67,4.45 63.5,4.45 60.33,3.17 57.15,3.17 53.98,3.17 50.8,3.17 47.62,4.45 44.45,4.45 41.27,4.45 38.1,6.35 34.92,6.35 31.75,6.35 28.57,6.35 25.4,3.81 22.23,2.54 19.05,2.54 16.51,4.45 13.97,6.99 10.79,6.99 6.35,5.08 9.53,5.08 12.7,3.81 28.57,3.81 36.2,4.45 72.39,4.45 1.27,10.16 1.27,5.08 1.27,15.24 1.27,18.41 1.27,21.59 1.27,24.77 1.27,27.94 1.27,31.11 1.27,34.29 1.27,37.47 1.27,41.27 1.27,44.45 4.45,31.11 4.45,34.29 3.81,37.47 3.81,41.27 4.45,44.45 4.45,47.62 1.27,47.62 1.27,50.8 4.45,50.8 1.27,53.98 1.27,57.15 1.27,59.69 1.27,62.87 1.27,66.04 1.27,68.58 5.08,68.58 5.08,66.04 5.08,62.87 8.26,68.58 8.26,72.39 11.43,72.39 11.43,68.58 14.61,72.39 14.61,68.58 17.78,72.39 17.78,68.58 17.78,64.77 20.95,64.77 20.95,68.58 20.95,72.39 20.95,62.23 17.78,62.23 24.13,72.39 24.13,68.58 24.13,64.77 27.3,70.48 30.48,70.48 33.66,70.48 36.83,72.39 36.83,68.58 36.83,64.77 36.83,60.96 40.01,72.39 40.01,68.58 40.01,64.77 43.18,64.77 46.35,64.77 49.53,64.77 49.53,60.96 46.35,60.96 43.18,60.96 40.01,60.96 63.5,72.39 63.5,68.58 66.67,72.39 69.85,72.39 73.03,72.39 76.2,72.39 76.2,68.58 73.03,68.58 69.85,68.58 66.67,68.58 80.64,68.58 80.64,65.41 80.64,62.23 80.64,59.05 80.64,55.88 80.64,52.7 80.64,49.53 80.64,46.35 76.83,46.35 73.03,46.35 73.03,49.53 76.83,49.53 76.83,52.7 76.83,55.88 73.03,55.88 69.22,59.05 73.03,59.05 76.83,59.05 76.83,62.23 73.03,62.23 69.22,62.23 81.28,34.92 81.28,31.75 81.28,28.57 81.28,25.4 81.28,22.23 81.28,19.05 77.47,19.05 77.47,22.23 77.47,25.4 77.47,28.57 77.47,31.75 77.47,34.92 79.38,24.13 79.38,20.95 69.85,10.79 66.67,10.79 64.14,9.53 64.14,7.62 66.67,7.62
  pour Bottom: 55.24,21.59 59.05,21.59 59.05,17.78 55.24,17.78
  pour Top: 0,74.3 82.55,74.3 82.55,60.33 80.01,60.33 79.38,60.33 69.85,69.85 36.83,69.85 34.92,67.94 26.67,67.94 26.67,65.41 13.34,65.41 9.53,61.59 0,61.59
  pour Top: 82.55,73.66 82.55,0 64.14,0 64.14,3.81 71.75,11.43 78.11,11.43 79.63,12.45 79.63,15.49 78.11,16.51 76.83,16.51 76.83,34.29 74.3,36.83 74.3,38.35 74.42,38.48 78.74,38.48 79.5,39.24 79.5,41.4 78.36,42.55 73.66,42.55 72.39,43.81 72.39,51.44 67.94,55.88 67.94,63.5 61.59,69.85 61.59,73.66
  pour Top: 82.55,0 0,0 0,10.16 2.54,10.16 2.54,8.89 3.81,7.62 14.61,7.62 19.05,3.17 23.75,3.17 26.16,5.59 50.8,5.59 50.8,5.08 52.07,3.81 55.88,3.81 57.15,5.08 82.55,5.08
  pour Top: 0,0 0,53.34 5.08,53.34 5.08,36.83 5.08,36.2 8.26,33.02 8.26,30.48 5.08,30.48 4.45,29.84 4.45,28.57 1.91,26.04 1.91,17.14 3.81,15.24 7.62,15.24 8.89,13.97 8.89,12.19 3.81,12.19 2.92,11.3 2.92,9.14 4.45,7.62 4.45,0
  pour Top: 34.29,73.66 34.29,59.69 43.81,59.69 46.35,57.15 50.8,57.15 51.44,57.78 51.44,58.42 50.16,59.69 50.16,64.77 53.34,67.94 63.5,67.94 63.5,73.66
  pour Top: 45.72,57.15 45.72,55.24 48.26,55.24 49.53,53.98 49.53,50.67 51.82,50.67 51.82,49.78 52.7,49.78 52.7,51.94 50.67,53.98 50.67,57.15
  pour Top: 24.77,73.66 24.77,64.77 15.24,55.24 15.24,53.98 5.08,43.81 0,43.81 0,73.66
  pour Bottom: 0,73.66 81.92,73.66 81.92,60.33 79.38,60.33 70.48,60.33 64.14,66.67 17.14,66.67 14.61,64.14 0,64.14
  pour Bottom: 82.55,73.66 82.55,0 73.66,0 73.66,10.79 74.93,12.06 80.01,12.06 80.01,15.88 74.3,15.88 74.3,29.21 67.31,36.2 66.67,73.66
  pour Bottom: 82.55,0 0,0 0,8.26 24.13,8.26 31.75,15.88 34.29,15.88 39.37,20.95 43.81,20.95 52.07,12.7 55.88,12.7 57.15,11.43 57.15,9.53 55.88,8.26 52.07,8.26 50.8,6.99 50.8,5.71 52.07,4.45 60.96,4.45 62.87,6.35 62.87,10.16 64.77,12.06 82.55,12.06
  pour Bottom: 0,0 0,50.8 5.71,50.8 5.71,39.37 5.71,36.2 8.26,33.66 8.26,19.05 19.05,8.26 19.05,0
  pour Bottom: 0,50.8 0,64.14 3.17,64.14 3.17,62.87 2.54,62.87 1.27,61.59 1.27,52.07 2.54,50.8
  pour Bottom: 8.89,62.87 0,62.87 0,73.66 8.89,73.66
  pour Bottom: 12.7,74.3 12.7,64.77 13.34,64.14 15.24,64.14 17.78,61.59 31.75,61.59 33.66,59.69 52.07,59.69 52.7,60.33 52.7,62.23 56.52,66.04 59.69,66.04 59.69,74.3
  pour Top: 26.67,7.62 41.91,7.62 42.16,7.62 42.16,4.7 26.67,4.7
  pour Top: 61.59,5.08 62.87,6.35 62.87,10.16 64.77,12.06 81.92,12.06 81.92,5.08
IN
  Top 0.305: X2.1 C1.1
LCD_CS1  (via drill 0.4 pad 0.61)
  Top 0.305: v25.15,22.16 X5.15 | IC12.42 23.92,29.27 v24.05,29.15
  Bottom 0.305: v24.05,29.15 24.05,27.2 25.15,26.1 v25.15,22.16
LCD_CS2  (via drill 0.4 pad 0.61)
  Top 0.305: X5.16 v25.65,27.38 | v25.02,29.15 24.57,29.59 IC12.43
  Bottom 0.305: v25.65,27.38 25.65,28.58 v25.02,29.15
LCD_D0  (via drill 0.4 pad 0.61)
  Top 0.305: v21.08,22.16 21.08,23.39 X5.7 | v20.95,28.7 20.95,29.02 21.32,29.39 IC12.38
  Bottom 0.305: v20.95,28.7 20.95,22.29 v21.08,22.16
LCD_D1
  Top 0.305: IC12.39 21.97,29.34 21.65,29.01 X5.8
LCD_D2  (via drill 0.4 pad 0.61)
  Top 0.305: IC12.40 22.62,29.04 v22.29,28.7 | v22.1,22.16 22.15,22.21 X5.9
  Bottom 0.305: v22.29,28.7 22.1,28.45 v22.1,22.16
LCD_D3
  Top 0.305: IC12.41 23.27,28.61 22.65,27.66 X5.10
LCD_D4  (via drill 0.4 pad 0.61)
  Top 0.305: X5.11 v23.15,22.16 | v26.29,31.05 IC12.2
  Bottom 0.305: v23.15,22.16 23.15,26.19 23.05,26.29 23.05,28.32 22.92,28.45 22.92,29.79 24.18,31.05 v26.29,31.05
LCD_D5
  Top 0.305: IC12.3 26.6,31.7 27.62,30.68 27.62,29.41 26.72,28.51 24.32,28.51 23.62,27.75 23.62,26.48 X5.12
LCD_D6  (via drill 0.4 pad 0.61)
  Top 0.305: X5.13 v24.15,22.16 | v26.83,32.35 IC12.4
  Bottom 0.305: v24.15,22.16 24.15,26.04 23.56,26.62 23.56,28.51 23.37,28.7 23.37,29.53 23.94,30.1 26.24,30.1 26.92,30.79 26.92,32.26 v26.83,32.35
LCD_D7
  Top 0.305: X5.14 24.65,27.57 25.08,28.07 27,28.07 28.13,29.2 28.13,32.03 27.15,33.01 IC12.5
LCD_E
  Top 0.305: X5.6 20.65,28 20.02,28.62 IC12.36
LCD_MCLR  (via drill 0.4 pad 0.61)
  Top 0.305: IC12.18 21.32,37.99 v21.21,38.1 21.34,38.1 JP4.1
  Bottom 0.305: v21.21,38.1 21.21,36.92 R37.2
LCD_PGC
  Top 0.305: IC12.16 22.62,37.86 23.88,39.12 JP4.5
LCD_PGD
  Top 0.305: IC12.17 21.97,38.1 22.61,38.73 JP4.3
LCD_RS
  Top 0.305: IC12.34 18.72,29.52 18.41,29.21 18.41,28.57 19.68,27.3 19.68,26.37 X5.4
LCD_RST  (via drill 0.4 pad 0.61)
  Top 0.305: v26.16,22.16 26.15,22.3 X5.17 | v26.11,29.29 25.68,29.41 IC12.44
  Bottom 0.305: v26.11,29.29 26.16,29.4 26.42,29.15 26.42,26.35 26.16,26.1 v26.16,22.16
LCD_RW  (via drill 0.4 pad 0.61)
  Top 0.305: IC12.35 19.37,29.15 v19.18,28.96 | X5.5 20.15,22.3 v20.07,22.16
  Bottom 0.305: v20.07,22.16 20.07,28.07 v19.18,28.96
LOCK_DETECT  (via drill 0.4 pad 0.61)
  Top 0.305: IC7.20 65.73,29.2 v65.6,29.34 | IC4.24 v56.83,28.77
  Bottom 0.305: v65.6,29.34 65.22,29.72 58.04,29.72 57.15,28.83 arc-90 57.09,28.77 v56.83,28.77
N$1
  Top 0.61: D1.C D2.A 19.38,17.55 Q1.3 19.22,15.24 R2.1 17.3,15.14 R1.1 C2.2 15.03,13.55 13.97,14.61 13.97,16.38 13.36,17 K2.5
N$2
  Top 0.61: C1.2 17.3,10.26 R1.2 C2.1
N$3
  Top 0.61: Q1.2 22,16.77 C3.1 R3.1 27.26,16.77 arc-90 R4.2
N$4
  Top 0.61: Q2.B Q1.1 Q1.1 arc90 21.07,13.95 R5.3 21.07,5.86 R5.2
N$5
  Top 0.61: R4.1 27.73,14.71 C5.2 27.73,13.49 Q2.C
N$6
  Top 0.61: R6.2 31.45,9.63 R8.3
N$7
  Top 0.61: 29.69,13.02 R7.2 31.91,14.71 D3.A 31.91,13.94 33.46,12.39 Q3.B | R6.1 29.69,13.02 | 29.69,13.02 C5.1
N$8
  Top 0.61: Q3.E 35.88,13.05 36.28,13.46 37.01,13.46 37.47,13.92 Q4.E R9.2
N$9
  Top 0.61: Q4.B 41.18,14.59 arc-90 R11.1 | R11.1 C7.2 45.72,14.5 arc90 R13.2 | R10.2 R11.1
N$10
  Top 0.61: Q4.C 38.42,10.32 R12.1 D4.A D5.A
N$11
  Top 0.61: D4.C 44.08,10.31 Q5.C 47.52,11.41 R13.1 | R13.1 R18.2 | R16.2 47.5,14.63 arc90 R13.1
N$12
  Top 0.61: D5.C 44.08,8 | 44.08,8 44.08,6.67 R14.1 | Q5.B 45.72,8 44.08,8
N$13
  Bottom 0.61: IC1.8 12.19,50.26 C8.+
  Bottom 1.27: D6.C 13.31,51.55 C8.+
N$14
  Top 0.61: R17.1 R15.1 10.22,18.61 10.81,19.2 K2.6
N$15  (via drill 0.4 pad 0.61)
  Top 0.305: IC7.14 68.82,30.55 v68.39,30.99
  Bottom 0.305: v68.39,30.99 69.1,30.27 C14.1
N$16
  Top 0.61: IC3.8 60.29,8.73 60.67,9.11 C13.1
N$17
  Top 0.305: IC7.16 67.82,30.6 67.75,30.67 C15.1
N$18
  Top 0.305: 67.7,33.85 C15.2 | 66.22,33.85 R20.1
  Top 0.61: C15.2 C16.1 | 67.7,33.85 66.22,33.85
N$19
  Top 0.305: C17.1 69.82,31.56 IC7.12
N$20  (via drill 0.4 pad 0.61)
  Top 0.305: IC7.13 69.32,31.01 69.03,31.3 v69.03,31.94
  Bottom 0.305: v69.03,31.94 67.75,31.94 67.04,31.23 R21.1
N$21
  Bottom 0.305: R22.1 68.71,21.14 C19.1
N$22
  Top 0.305: IC7.4 68.32,25.84 67.44,24.96 C21.1 67.29,23.73
  Top 0.61: 67.29,23.73 L4.1
N$23  (via drill 0.4 pad 0.61)
  Top 0.305: IC7.7 70.43,27.2 v70.61,27.18
  Bottom 0.61: v70.61,27.18 71.56,27.18 72.1,26.64 R23.1 C20.2
N$24  (via drill 0.4 pad 0.61)
  Top 0.305: v65.69,25.11 65.69,26.86 66.03,27.2 IC7.24
  Bottom 0.305: C18.2 66.59,24.56 | C18.2 66.27,24.54 v65.69,25.11 | C18.2 C19.2 69.44,25.27 R23.2
N$25
  Top 0.305: IC7.5 68.82,25.79 69.66,24.96 C22.2
  Top 0.61: L3.1 71.3,23.58 C22.2
N$26
  Top 0.305: IC7.10 71.12,28.7 R24.1 72.2,29.62
  Top 0.61: 72.2,29.62 L2.1
N$27
  Top 0.305: IC7.9 71.12,28.2 R25.1 71.99,27.33
  Top 0.61: 71.99,27.33 L1.1
N$28  (via drill 0.4 pad 0.61)
  Top 0.305: IC12.33 16.58,30.41 Q10.3 16.58,29.4 v16.83,29.15
  Bottom 0.305: v16.83,29.15 16.83,30.07 C53.1
N$29  (via drill 0.4 pad 0.61)
  Top 0.305: IC4.33 55.62,34.63 Q8.3 57.21,35.5 v56.9,35.81
  Bottom 0.305: v56.9,35.81 56.9,34.96 C46.1
N$30  (via drill 0.4 pad 0.61)
  Top 0.305: IC4.32 56.26,33.97 v56.26,33.91 | Q8.1 59.56,33.18 v59.56,32.89
  Bottom 0.305: v56.26,33.91 58.1,33.91 58.63,33.38 C45.1 v59.56,32.89
N$31
  Top 0.305: C36.+ IC11.25
N$32
  Top 0.305: IC11.10 52.13,47.98 R26.1
N$33
  Top 0.305: R28.1 54.48,63.37 | 54.48,63.37 R29.2 | X4.3 60.45,60.96 58.17,63.25 54.61,63.25 54.48,63.37
  Top 0.406: C43.1 L5.2
  Top 0.61: R28.1 C43.1
N$34  (via drill 0.4 pad 0.61)
  Top 0.305: IC11.6 47.14,44.96 v47.24,44.83
  Bottom 0.305: v47.24,44.83 46.7,45.38 R27.1
N$35
  Bottom 0.61: R32.1 54.83,61.95 X4.9
N$36
  Bottom 0.305: R33.1
  Bottom 0.61: R33.1 X4.12
N$37
  Top 0.305: X4.6 64.77,56.52 62.48,54.23 59.94,54.23 59.31,54.86 54.48,54.86
  Top 0.61: R31.2 54.48,54.86 R30.1 C44.1
N$38  (via drill 0.4 pad 0.61)
  Top 0.305: Q10.1 15.43,32.83 v15.18,33.08 | IC12.32 17.59,31.05 arc-90 v17.53,31.11
  Bottom 0.305: v17.53,31.11 15.62,31.11 15.15,31.59 C52.1 15.18,32.16 v15.18,33.08
N$39  (via drill 0.4 pad 0.61)
  Top 0.305: X5.3 19.15,22.16 v19.05,22.16 | v36.96,22.61 37.04,22.69 R34.2
  Bottom 0.305: v19.05,22.16 19.05,21.92 20.02,20.95 35.31,20.95 v36.96,22.61
N$40
  Top 0.305: X5.18 26.65,26.96 27.62,27.94 29.52,27.94 R34.1
N$41
  Top 0.61: X5.19 R38.1
N$42
  Top 0.406: Q11.C 12.2,26.84 | R40.2
  Top 0.61: 12.2,26.84 K2.8 R40.2 | D7.2 Q11.C
N$43  (via drill 0.4 pad 0.61)
  Top 0.305: K1.8 65.33,47.75 | 64.01,47.74 v63.88,47.75
  Top 0.61: 65.33,47.75 Q13.C | K1.8 64.01,47.74
  Bottom 0.305: 62.93,47.75 D8.2
  Bottom 0.61: 62.93,47.75 v63.88,47.75 63.88,44.41 R42.2
N$44
  Top 0.406: K2.1 5.46,24.6
  Top 0.61: R39.2 K2.1 | 5.46,24.6 Q9.C D7.1
N$45  (via drill 0.4 pad 0.61)
  Top 0.305: Q12.C 55.41,47.74 | K1.1 58.64,47.75
  Top 0.61: 55.41,47.74 K1.1 | 58.64,47.75 v60.07,47.75
  Bottom 0.305: 61.03,47.75 D8.1
  Bottom 0.61: 61.03,47.75 v60.07,47.75 60.07,44.41 R41.2
N$46
  Top 0.305: R43.2 57.06,43.43 61.09,43.43 63.37,45.72 69.23,45.72 Q13.B
N$47
  Top 0.305: 54.42,42.83 R44.2
  Top 0.61: Q12.B 54.42,42.83
N$48
  Top 0.305: 13.08,29.1 Q11.B
  Top 0.61: R45.2 13.08,29.1
N$49
  Top 0.305: Q9.B 6.41,28.51 6.99,27.94 12.19,27.94 12.19,30.35 11.05,31.5 R46.1
N$50  (via drill 0.4 pad 0.61)
  Top 0.61: LED1.C v51.69,40.01
  Bottom 0.61: v51.69,40.01 R47.1
N$51  (via drill 0.4 pad 0.61)
  Top 0.61: LED2.C v53.09,40.01
  Bottom 0.61: v53.09,40.01 53.21,40.3 R48.1
N$52  (via drill 0.4 pad 0.61)
  Top 0.61: LED3.C 63.66,15.75 v64.9,15.75
  Bottom 0.61: v64.9,15.75 65.19,15.75 R49.1
N$53
  cutout Top: 15.88,59.82 arc-90 14.47,58.42 12.28,58.42 arc-90 10.79,59.9 arc-90 11.85,61.09 14.74,61.09 arc-90
N$54
  Top 0.406: 34.29,58.26 R50.1
  Top 0.813: LED4.C 34.29,58.26
N$55
  cutout Top: 4.65,60.96 3.44,60.96 arc90 2.54,60.06 2.54,54.61 arc90 3.17,53.98 4.65,53.98 arc90 5.33,54.66 5.33,60.28 arc90
N$56
  cutout Bottom: 4.98,8.89 arc-90 3.81,10.06 3.81,10.22 arc-90 5.15,11.43 arc-90 6.35,10.36 6.35,10.14 arc-90
PLL_CLK  (via drill 0.4 pad 0.61)
  Top 0.305: IC7.17 67.32,30.59 v66.42,31.5 | IC4.27 55.62,30.73 v56.26,30.73
  Bottom 0.305: v56.26,30.73 56.52,30.73 57.02,31.24 64.52,31.24 64.77,31.5 v66.42,31.5
PLL_DATA  (via drill 0.4 pad 0.61)
  Top 0.305: IC4.26 v56.8,30.07 | IC7.18 66.69,30.21 v66.29,30.61
  Bottom 0.305: v56.8,30.07 57.53,30.8 64.83,30.8 65.02,30.99 65.91,30.99 v66.29,30.61
PLL_LE  (via drill 0.4 pad 0.61)
  Top 0.305: IC4.25 v56.28,29.42 | IC7.19 66.25,29.7 65.6,30.35 v65.41,30.35
  Bottom 0.305: 65.15,30.35 v65.41,30.35 58.04,30.35 57.1,29.42 v56.28,29.42
PLL_LOCK
  Top 0.305: LED1.A 51.82,37.18 IC4.39
PRESCALED_FREQ
  Top 0.305: IC6.22 55.9,12.35 C12.1 | 55.9,10.29 R19.1
  Top 0.61: IC3.4 54.7,4.92 55.85,6.08 R19.1 55.85,12.31 55.9,12.35
REF_EXT
  Top 0.61: K1.7 67.22,44.54 71.37,40.39 X3.1
REF_IN
  Top 0.305: C16.2 67.75,37.85
  Top 0.61: K1.6 66.62,42.34 67.75,41.21 C16.2
REF_INT
  Top 0.305: Q6.3 65.44,37.85 65.5,37.85 | K1.5 65.29,40.11
  Top 0.61: 65.29,40.11 Q6.3
REF_RESET
  Top 0.305: IC4.35 54.42,41 R44.1
REF_SET
  Top 0.305: IC4.34 55.07,38.56 56.39,39.88 R43.1
RFOUTA
  Top 0.61: C21.2 66.61,21.06 T1.P$3
RFOUTB
  Top 0.61: C22.1 70.61,20.93 T1.P$1
SHAPED_FREQ
  Top 0.61: 50.71,14.61 R18.1 50.71,14.53 R51.1 50.71,10.25 52.23,8.73 IC3.1
SPI_CLK  (via drill 0.4 pad 0.61)
  Top 0.305: IC10.6 45.09,29.21 45.53,28.77 v45.85,28.77 | IC11.4 v45.85,34.54 41.02,34.54 41.02,35.85 | IC6.49 60.9,24.51 v61.21,24.89 | IC4.10 v45.85,28.77 | v45.85,28.77 | IC5.13 34.4,51.56 34.8,51.16 34.8,45.47 37.85,42.42 39.4,42.42 41.02,40.79 41.02,35.85 | IC8.2 41.02,35.85
  Bottom 0.305: v45.85,34.54 v45.85,28.77 48.07,26.54 59.56,26.54 v61.21,24.89
SPI_CLK_HI
  Top 0.305: IC12.10 26.48,36.26 27.18,36.96 29.84,36.96 30.3,36.5 IC8.12
SPI_COUNTER
  Top 0.305: IC4.15 50.52,26.83 51.82,25.53 58.93,25.53 59.4,25.05 IC6.52
SPI_ETH
  Top 0.305: IC11.5 46.51,37.69 48.57,35.63 IC4.44
SPI_FLASH  (via drill 0.4 pad 0.61)
  Top 0.305: IC4.3 47.58,33.32 46.99,33.91 v41.53,33.91 | v36.83,32.51 36.83,31.77 IC10.1
  Bottom 0.305: v41.53,33.91 40.01,33.91 39.62,33.53 37.85,33.53 v36.83,32.51
SPI_LCD  (via drill 0.4 pad 0.61)
  Top 0.305: IC8.6 43.94,38.45 v43.81,38.48 | v49.02,36.2 49.22,36 IC4.43
  Bottom 0.305: v43.81,38.48 46.74,38.48 v49.02,36.2
SPI_LCD_HI
  Top 0.305: IC12.14 23.92,37.76 25.25,39.1 IC8.8
SPI_SDI  (via drill 0.4 pad 0.61)
  Top 0.305: IC4.9 45.51,29.42 45.09,29.84 v44.58,29.84 | IC10.2 36.35,30.48 v35.31,30.48 | IC6.47 62.28,22.93 v62.48,22.73 | IC11.2 44.55,37.8 | 44.55,37.8 v44.55,36.04 | 44.55,37.8 IC8.5 42.14,37.8 41.66,38.28 41.66,40.1 42.29,40.74 42.29,41.37 40.22,43.43 38.27,43.43 35.81,45.89 35.81,51.58 34.53,52.87 IC5.15
  Bottom 0.305: v62.48,22.73 61.59,22.73 58.8,25.53 46.74,25.53 44.55,27.71 44.55,29.84 | v44.55,36.04 44.55,29.84 | v44.58,29.84 44.55,29.84 | 44.55,29.84 35.94,29.84 v35.31,30.48
SPI_SDI_HI  (via drill 0.4 pad 0.61)
  Top 0.305: IC12.1 26.24,30.41 v26.92,29.72 | IC8.9 38.39,38.45 38.86,37.97 v38.86,34.29
  Bottom 0.305: v26.92,29.72 28.32,31.11 28.32,32 30.35,34.04 38.61,34.04 v38.86,34.29
SPI_SDO  (via drill 0.4, 0.4 pad 0.61)
  Top 0.305: 45.09,45.64 IC11.3 45.19,35.52 v45.21,35.24 | IC6.48 62.3,23.43 v62.48,23.62 | IC10.5 45.09,27.94 arc90 v45.21,28.07 | v47.56,35.24 47.56,35.09 IC4.1 | v45.21,35.24 | IC8.1 45.21,35.2 v45.21,35.24 | IC5.16 34.57,53.52 36.32,51.77 36.32,46.15 38.53,43.94 40.56,43.94 42.93,41.58 v42.93,40.51
  Bottom 0.305: v45.21,35.24 v45.21,28.07 47.24,26.04 59.05,26.04 61.47,23.62 v62.48,23.62 | v47.56,35.24 v45.21,35.24 | v45.21,35.24 45.21,36.82 44.22,37.82 43.48,37.82 43.18,38.12 43.18,40.26 v42.93,40.51
SPI_SDO_HI
  Top 0.305: IC12.9 26.71,35.6 27.43,36.32 29.72,36.32 30.19,35.85 IC8.13
SPI_USB  (via drill 0.4 pad 0.61)
  Top 0.305: IC5.14 34.48,52.22 35.31,51.4 35.31,45.72 38.1,42.93 39.75,42.93 v41.66,41.02 | v49.02,37.21 49.87,36.37 IC4.42
  Bottom 0.305: v41.66,41.02 41.91,41.15 45.09,41.15 v49.02,37.21
STAT_LED
  Top 0.305: IC4.38 52.47,35.83 53.09,36.45 LED2.A
SW
  Bottom 1.27: S1.1 8.18,54.93 D6.A
SW1  (via drill 0.4 pad 0.61)
  Top 0.305: IC3.3 v52.1,6.19 | IC6.28 v58.9,13.34
  Bottom 0.305: v52.1,6.19 55.72,6.19 58.9,10.01 v58.9,13.34
SW2
  Top 0.305: IC6.29 59.4,13.75 59.69,13.46 59.69,12.7 61.59,11.43 61.59,6.99 60.8,6.19 IC3.6
SW3  (via drill 0.4 pad 0.61)
  Top 0.305: IC3.7 v60.45,7.46 | v60.45,13.34 59.9,13.89 IC6.30
  Bottom 0.305: v60.45,13.34 v60.45,7.46
TPIN+  (via drill 0.4 pad 0.61)
  Top 0.305: X4.7 60.87,57.24 R30.2 | IC11.9 50.77,47.35 v50.8,47.24
  Bottom 0.305: v50.8,47.24 56.13,47.24 62.23,53.34 X4.7
TPIN-  (via drill 0.4 pad 0.61)
  Top 0.305: R31.1 62.65,52.49 X4.8 | IC11.8 50.34,46.69 v50.8,46.23
  Bottom 0.305: v50.8,46.23 56.39,46.23 X4.8
TPOUT+  (via drill 0.4 pad 0.61)
  Top 0.305: X4.1 60.11,65.62 R28.2 | IC11.13 50.77,49.94 v50.8,49.91
  Bottom 0.305: v50.8,49.91 51.05,50.16 56.52,50.16 59.69,53.34 59.69,60.96 X4.1
TPOUT-  (via drill 0.4 pad 0.61)
  Top 0.305: X4.2 64.77,61.47 62.99,59.69 55.66,59.69 R29.1 | IC11.12 50.39,49.3 v50.8,48.9
  Bottom 0.305: v50.8,48.9 56.52,48.9 60.96,53.34 60.96,59.18 61.59,59.82 63.12,59.82 64.77,61.47 X4.2
USB_D+
  Top 0.305: IC5.21 30.22,65.07 X1.3
USB_D-
  Top 0.305: IC5.20 30.87,65.16 X1.2
USB_PWR
  Top 0.406: LED4.A 31.7,60.87 X1.1

## Text on the board
tPlace: Frequency Counter | Guinea Pig Edidion | Rev.alpha | USB Pwr | ICSP | LOCK | 10MHz input | ICSP | ICSP | GATE | Gate output | RF Input
tNames: ICSP | !MCLR! | Vdd | PGD | PGC | GND